# Altium schematic sheet SwitchPower.SchDoc: 变频器开关电源
size A4; DrawnBy: xiaofei; Address2: 上海泰普克科技
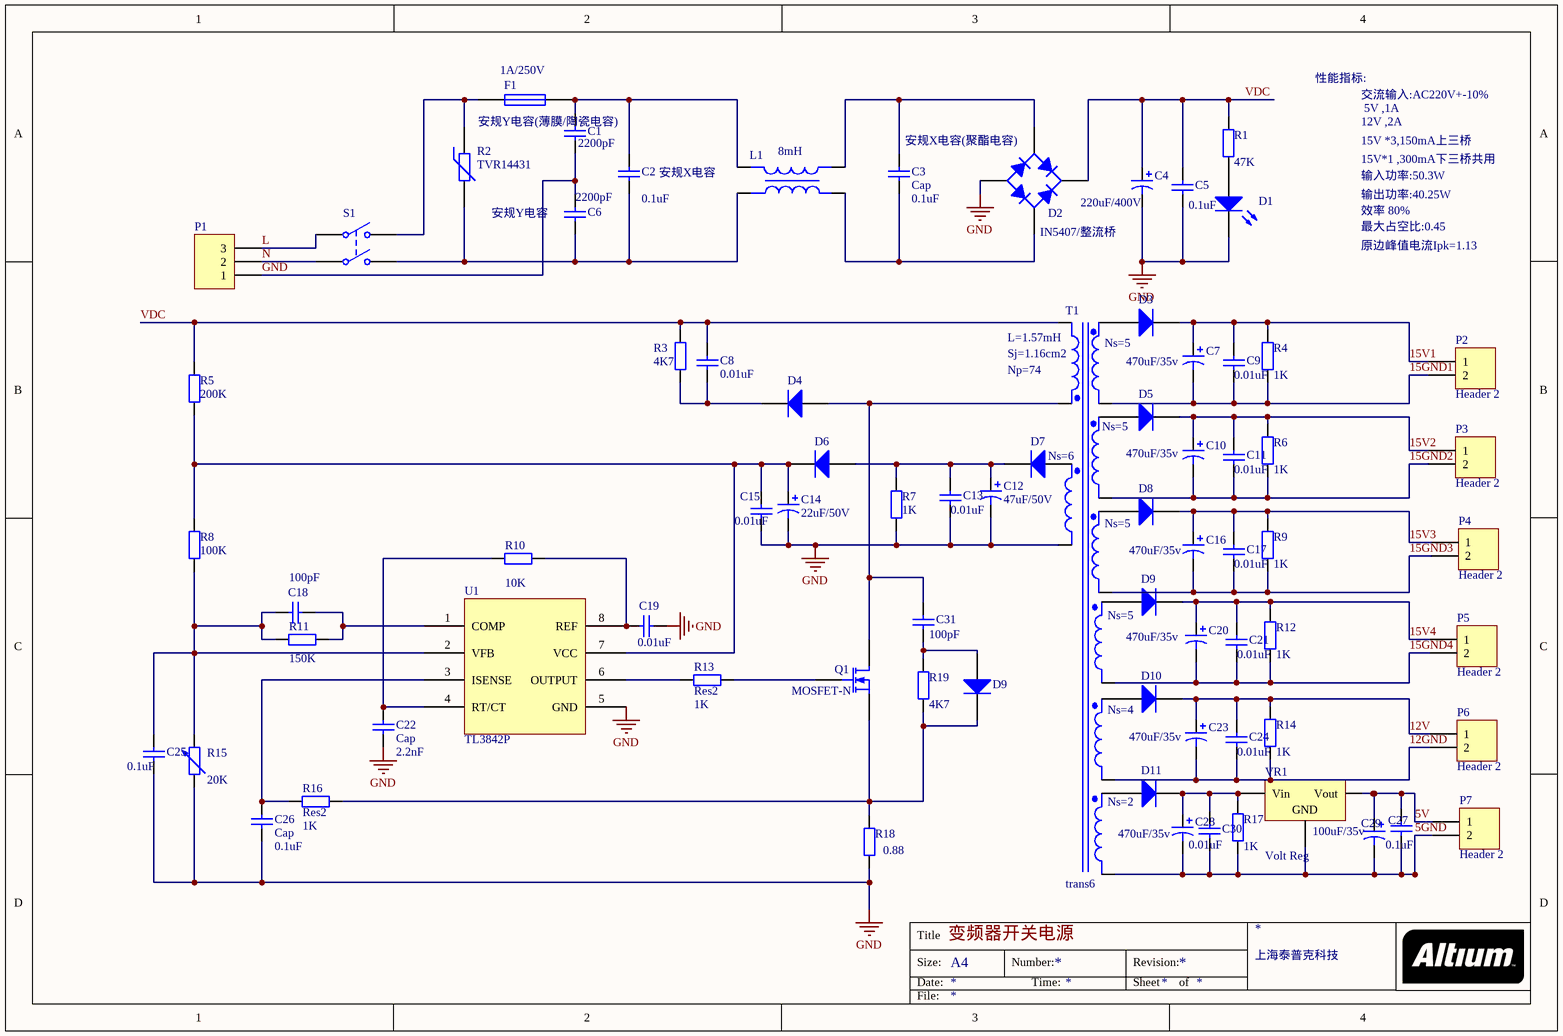
[diagram p0: SwitchPower.SchDoc]

## Parts
(Parts that share a designator on the sheet are numbered #1, #2 ... from top to bottom, then left to right.)
C1  value 2200pF  [RAD-0.3]  (hidden comment: Cap)
C2  value 0.1uF  [RAD-0.3]  (hidden comment: Cap)
C3  Cap  value 0.1uF  [RAD-0.3]
C4  value 220uF/400V  [RB7.6-15]  (hidden comment: Cap Pol1)
C5  value 0.1uF  [RAD-0.3]  (hidden comment: Cap)
C6  value 2200pF  [RAD-0.3]  (hidden comment: Cap)
C7  value 470uF/35v  [RB7.6-15]  (hidden comment: Cap Pol1)
C8  value 0.01uF  [RAD-0.3]  (hidden comment: Cap)
C9  value 0.01uF  [RAD-0.3]  (hidden comment: Cap)
C10  value 470uF/35v  [RB7.6-15]  (hidden comment: Cap Pol1)
C11  value 0.01uF  [RAD-0.3]  (hidden comment: Cap)
C12  value 47uF/50V  [RB7.6-15]  (hidden comment: Cap Pol1)
C13  value 0.01uF  [RAD-0.3]  (hidden comment: Cap)
C14  value 22uF/50V  [RB7.6-15]  (hidden comment: Cap Pol1)
C15  value 0.01uF  [RAD-0.3]  (hidden comment: Cap)
C16  value 470uF/35v  [RB7.6-15]  (hidden comment: Cap Pol1)
C17  value 0.01uF  [RAD-0.3]  (hidden comment: Cap)
C18  value 100pF  [RAD-0.3]  (hidden comment: Cap)
C19  value 0.01uF  [RAD-0.3]  (hidden comment: Cap)
C20  value 470uF/35v  [RB7.6-15]  (hidden comment: Cap Pol1)
C21  value 0.01uF  [RAD-0.3]  (hidden comment: Cap)
C22  Cap  value 2.2nF  [RAD-0.3]
C23  value 470uF/35v  [RB7.6-15]  (hidden comment: Cap Pol1)
C24  value 0.01uF  [RAD-0.3]  (hidden comment: Cap)
C25  value 0.1uF  [RAD-0.3]  (hidden comment: Cap)
C26  Cap  value 0.1uF  [RAD-0.3]
C27  value 0.1uF  [RAD-0.3]  (hidden comment: Cap)
C28  value 470uF/35v  [RB7.6-15]  (hidden comment: Cap Pol1)
C29  value 100uF/35v  [RB7.6-15]  (hidden comment: Cap Pol1)
C30  value 0.01uF  [RAD-0.3]  (hidden comment: Cap)
C31  value 100pF  [RAD-0.3]  (hidden comment: Cap)
D1  LED0  [LED-0]  (value not drawn)
D2  Bridge1  [D-38]  (value not drawn)
D3  Diode  [SMC]  (value not drawn)
D4  Diode  [SMC]  (value not drawn)
D5  Diode  [SMC]  (value not drawn)
D6  Diode  [SMC]  (value not drawn)
D7  Diode  [SMC]  (value not drawn)
D8  Diode  [SMC]  (value not drawn)
D9#1  Diode  [SMC]  (value not drawn)
D9#2  Diode  [SMC]  (value not drawn)
D10  Diode  [SMC]  (value not drawn)
D11  Diode  [SMC]  (value not drawn)
F1  Fuse 1  [PIN-W2/E2.8]  (value not drawn)
L1  inductor  (value not drawn)
P1  MHDR1X3  [MHDR1X3]  (value not drawn)
P2  Header 2  [HDR1X2]
P3  Header 2  [HDR1X2]
P4  Header 2  [HDR1X2]
P5  Header 2  [HDR1X2]
P6  Header 2  [HDR1X2]
P7  Header 2  [HDR1X2]
Q1  MOSFET-N  [E3]
R1  value 47K  [AXIAL-0.4]  (hidden comment: Res2)
R2  TVR14431  [6-0805_N]
R3  value 4K7  [AXIAL-0.4]  (hidden comment: Res2)
R4  value 1K  [AXIAL-0.4]  (hidden comment: Res2)
R5  value 200K  [AXIAL-0.4]  (hidden comment: Res2)
R6  value 1K  [AXIAL-0.4]  (hidden comment: Res2)
R7  value 1K  [AXIAL-0.4]  (hidden comment: Res2)
R8  value 100K  [AXIAL-0.4]  (hidden comment: Res2)
R9  value 1K  [AXIAL-0.4]  (hidden comment: Res2)
R10  value 10K  [AXIAL-0.4]  (hidden comment: Res2)
R11  value 150K  [AXIAL-0.4]  (hidden comment: Res2)
R12  value 1K  [AXIAL-0.4]  (hidden comment: Res2)
R13  Res2  value 1K  [AXIAL-0.4]
R14  value 1K  [AXIAL-0.4]  (hidden comment: Res2)
R15  value 20K  [AXIAL-0.6]  (hidden comment: Res Adj2)
R16  Res2  value 1K  [AXIAL-0.4]
R17  value 1K  [AXIAL-0.4]  (hidden comment: Res2)
R18  value 0.88  [AXIAL-0.4]  (hidden comment: Res2)
R19  value 4K7  [AXIAL-0.4]  (hidden comment: Res2)
S1  SW-DPST  [DPST-4]  (value not drawn)
T1  trans6
U1  TL3842P  [TL3842P]
VR1  Volt Reg  [D2PAK_N]

## Nets
GND: C1.1 C4.2 C5.2 C6.2 C12.2 C13.2 C14.2 C15.2 C19.1 C22.1 C25.1 C26.1 D1.2(K) D2.3(A) P1.1 R7.1 R15.1 R18.1 T1.3(Pri2-) U1.5(GND)
5GND: C27.1 C28.2 C29.2 C30.2 P7.2 R17.1 T1.16(Sec6-) VR1.2(GND)
5V: C27.2 C29.1 P7.1 VR1.3(Vout)
12GND: C23.2 C24.2 P6.2 R14.1 T1.14(Sec5-)
12V: C23.1 C24.1 D10.2(K) P6.1 R14.2
15GND1: C7.2 C9.2 P2.2 R4.1 T1.6(Sec1-)
15GND2: C10.2 C11.2 P3.2 R6.1 T1.8(Sec2-)
15GND3: C16.2 C17.2 P4.2 R9.1 T1.10(Sec3-)
15GND4: C20.2 C21.2 P5.2 R12.1 T1.12(Sec4-)
15V1: C7.1 C9.1 D3.2(K) P2.1 R4.2
15V2: C10.1 C11.1 D5.2(K) P3.1 R6.2
15V3: C16.1 C17.1 D8.2(K) P4.1 R9.2
15V4: C20.1 C21.1 D9#1.2(K) P5.1 R12.2
L: P1.3 S1.1(COMMON1)
N: P1.2 S1.3(COMMON2)
VDC: C4.1 C5.1 C8.2 D2.1(K) R1.2 R3.2 R5.1 T1.1(Pri1-)
NetC1_2: C1.2 C2.1 F1.2 L1.1
NetC2_2: C2.2 C6.1 L1.3 R2.2 S1.4(NO2)
NetC3_1: C3.1 D2.4(C) L1.2
NetC3_2: C3.2 D2.2(C) L1.4
NetC8_1: C8.1 D4.2(K) R3.1
NetC12_1: C12.1 C13.1 D6.1(A) D7.2(K) R7.2
NetC14_1: C14.1 C15.1 D6.2(K) R5.2 R8.1 U1.7(VCC)
NetC18_1: C18.1 R11.1 U1.1(COMP)
NetC18_2: C18.2 C25.2 R8.2 R11.2 R15.2 U1.2(VFB)
NetC19_2: C19.2 R10.2 U1.8(REF)
NetC22_2: C22.2 R10.1 U1.4(RT/CT)
NetC26_2: C26.2 R16.2 U1.3(ISENSE)
NetC28_1: C28.1 C30.1 D11.2(K) R17.2 VR1.1(Vin)
NetC31_1: C31.1 D9#2.1(A) R19.2
NetC31_2: C31.2 D4.1(A) Q1.1(D) T1.2(Pri1+)
NetD1_1: D1.1(A) R1.1
NetD3_1: D3.1(A) T1.5(Sec1+)
NetD5_1: D5.1(A) T1.7(Sec2+)
NetD8_1: D8.1(A) T1.9(Sec3+)
NetD9#1_1: D9#1.1(A) T1.11(Sec4+)
NetD9#2_2: D9#2.2(K) Q1.3(S) R16.1 R18.2 R19.1
NetD10_1: D10.1(A) T1.13(Sec5+)
NetD11_1: D11.1(A) T1.15(Sec6+)
NetF1_1: F1.1 R2.1 S1.2(NO1)
NetQ1_2: Q1.2(G) R13.1
NetR13_2: R13.2 U1.6(OUTPUT)

Not connected (* = marked no-connect by the designer): D7 1(A); T1 4(Pri2+)

## Notes on the sheet
- (near F1) 1A/250V
- 性能指标:
- 交流输入:AC220V+-10%
- 5V ,1A
- 安规Y电容(薄膜/陶瓷电容)
- (near C2) 安规X电容
- (near L1) 8mH
- (near C3) 安规X电容(聚酯电容)
- 15V *3,150mA上三桥
- 15V*1 ,300mA下三桥共用
- 12V ,2A
- 输入功率:50.3W
- 安规Y电容
- (near D2) IN5407/整流桥
- 输出功率:40.25W
- 效率 80%
- 最大占空比:0.45
- 原边峰值电流Ipk=1.13
- (near T1) L=1.57mH
- (near T1) Sj=1.16cm2
- (near T1) Np=74
- (near T1) Ns=5
- Ns=6
- Ns=4
- Ns=2
- Title
- Size:
- Date:
- A4
- Number:
- Time:
- Revision:
- Sheet
- of
- File:

## Library data of the parts
C1-C3 C5 C6 C8 C9 C11 C13 C15 C17-C19 C21 C22 C24-C27 C30 C31 = Cap: Capacitor; Published: 8-Jun-2000; LatestRevisionDate: 17-Jul-2002; LatestRevisionNote: Re-released for DXP Platform.; PackageReference: RAD-0.3; Publisher: Altium Limited; PackageDescription: Radial Cap, Thru-Hole; 2 Leads; 0.3 in Pin Spacing
C4 C7 C10 C12 C14 C16 C20 C23 C28 C29 = Cap Pol1: Polarized Capacitor (Radial); Published: 8-Jun-2000; LatestRevisionDate: 17-Jul-2002; LatestRevisionNote: Re-released for DXP Platform.; PackageReference: RB7.6-15; Publisher: Altium Limited; PackageDescription: Polarized Capacitor (Radial); 2 Leads
D1 = LED0: Typical INFRARED GaAs LED; Published: 8-Jun-2000; LatestRevisionDate: 08-Jul-2005; LatestRevisionNote: Mech Layer 1 removed.; PackageReference: LED-0; Publisher: Altium Limited; PackageDescription: LED; 2 Leads
D2 = Bridge1: Full Wave Diode Bridge; Published: 8-Jun-2000; LatestRevisionDate: 29-May-2009; LatestRevisionNote: Sch pins A & K swapped.; DatasheetVersion: E2732B; PackageReference: D-38; Publisher: Altium Limited; PackageDescription: Bridge Rectifier; 4 Terminals; Body 9.4 x 9.4 mm (typ); Pitch 5.08 mm
D3-D8 D9#1 D9#2 D10 D11 = Diode: Default Diode; Published: 8-Jun-2000; LatestRevisionDate: 17-Jul-2002; LatestRevisionNote: Re-released for DXP Platform.; PackageVersion: Sep-1996; PackageReference: SMC; Publisher: Altium Limited; PackageDescription: DO-214-AB/SMC; 2 C-Bend Leads; Body 7.9 x 5.9 mm, inc. leads (LxW); Code_JEDEC: DO-214-AB
F1 = Fuse 1: Fuse; Published: 8-Jun-2000; LatestRevisionDate: 17-Jul-2002; LatestRevisionNote: Re-released for DXP Platform.; PackageReference: PIN-W2/E2.8; Publisher: Altium Limited; PackageDescription: Thru-Hole; 2 Leads
P1 = MHDR1X3: Header, 3-Pin; LatestRevisionDate: 17-Jul-2002; LatestRevisionNote: Re-released for DXP Platform.; Publisher: Altium Limited
P2-P7 = Header 2: Header, 2-Pin; LatestRevisionDate: 17-Jul-2002; LatestRevisionNote: Re-released for DXP Platform.; Publisher: Altium Limited
Q1 = MOSFET-N: N-Channel MOSFET; Published: 8-Jun-2000; LatestRevisionDate: 17-Jul-2002; LatestRevisionNote: Re-released for DXP Platform.; PackageVersion: 1995/1996; PackageReference: E3; Publisher: Altium Limited; PackageDescription: TO, Flat Index; 3 In-Line, Axial Leads; Body Dia. 4.6mm; Lead Dia. 0.5 mm (max)
R1 R3-R14 R16-R19 = Res2: Resistor; Published: 8-Jun-2000; LatestRevisionDate: 17-Jul-2002; LatestRevisionNote: Re-released for DXP Platform.; PackageReference: AXIAL-0.4; Publisher: Altium Limited; PackageDescription: Axial Device, Thru-Hole; 2 Leads; 0.4 in Pin Spacing
R2 = Res Varistor: Varistor (Voltage-Sensitive Resistor); Published: 24-Mar-1999; LatestRevisionDate: 29-May-2009; LatestRevisionNote: IPC-7351 Footprint Added.; PackageVersion: Mar-2003; PackageReference: 6-0805; Publisher: Altium Limited; PackageDescription: Chip Resistor 0805 Case Size; Code_IPC: RESC2012
R15 = Res Adj2: Variable Resistor; Set Position: 0.5; Published: 8-Jun-2000; LatestRevisionDate: 17-Jul-2002; LatestRevisionNote: Re-released for DXP Platform.; PackageReference: AXIAL-0.6; Publisher: Altium Limited; PackageDescription: Axial Device, Thru-Hole; 2 Leads; 0.6 in Pin Spacing
S1 = SW-DPST: Double-Pole, Single-Throw Switch; Published: 24-Mar-1999; LatestRevisionDate: 17-Jul-2002; LatestRevisionNote: Re-released for DXP Platform.; PackageReference: DPST-4; Publisher: Altium Limited; PackageDescription: Switch; 4 Leads
T1 = trans6: Four-winding Transformer (Ideal)
U1 = TL3842P: CURRENT-MODE PWM CONTROLLERS
VR1 = Volt Reg: Voltage Regulator; Published: 24-Mar-1999; LatestRevisionDate: 29-May-2009; LatestRevisionNote: IPC-7351 Footprint Added.; PackageReference: D2PAK; Publisher: Altium Limited; PackageDescription: 3-Pin Transistor Outline Package 2.54 mm Pitch, 15.1 mm Lead Span